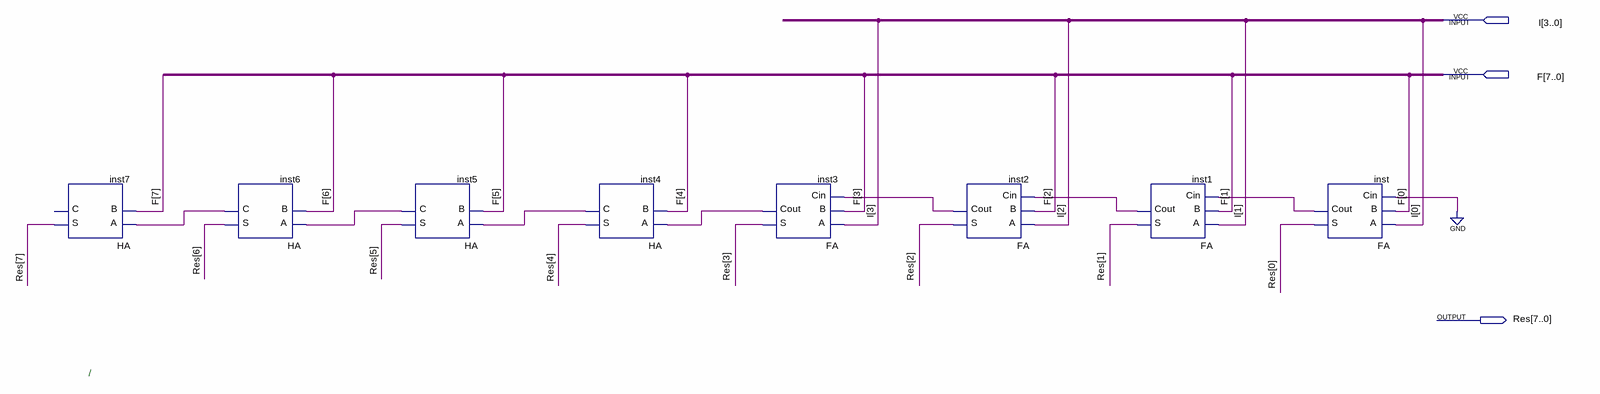
[diagram p0: schematic sheet]
// Quartus schematic Adder8_4bits.bdf as structural Verilog: 8 symbols, 3 pins
module Adder8_4bits (
  input  [3:0] I,
  input  [7:0] F,
  output [7:0] Res
);

  wire inst1_cout, inst2_cout, inst3_cout, inst4_c, inst5_c, inst6_c, inst_cout;

  HA inst7 (.A(inst6_c), .B(F[7]), .S(Res[7]));  // open: C
  HA inst6 (.A(inst5_c), .B(F[6]), .S(Res[6]), .C(inst6_c));
  HA inst5 (.A(inst4_c), .B(F[5]), .S(Res[5]), .C(inst5_c));
  HA inst4 (.A(inst3_cout), .B(F[4]), .S(Res[4]), .C(inst4_c));
  FA inst3 (.A(I[3]), .B(F[3]), .Cin(inst2_cout), .S(Res[3]), .Cout(inst3_cout));
  FA inst2 (.A(I[2]), .B(F[2]), .Cin(inst1_cout), .S(Res[2]), .Cout(inst2_cout));
  FA inst1 (.A(I[1]), .B(F[1]), .Cin(inst_cout), .S(Res[1]), .Cout(inst1_cout));
  FA inst (.A(I[0]), .B(F[0]), .Cin(1'b0), .S(Res[0]), .Cout(inst_cout));

  // Notes on the sheet:
  //   /
endmodule
